# Altium project LimeSDR-USB_1v4s.PrjPcb (part 2 of 7)

## Sheet 06_LMS7002M_RF2.SchDoc: LMS7002M RF
size A3; Organization: Lime Microsystems; Address1: Surrey Tech Centre; Address2: Guildford GU2 7YG; Address3: Surrey; Address4: United Kingdom; Revision: v1.4s; SheetNumber: 6; SheetTotal: 15
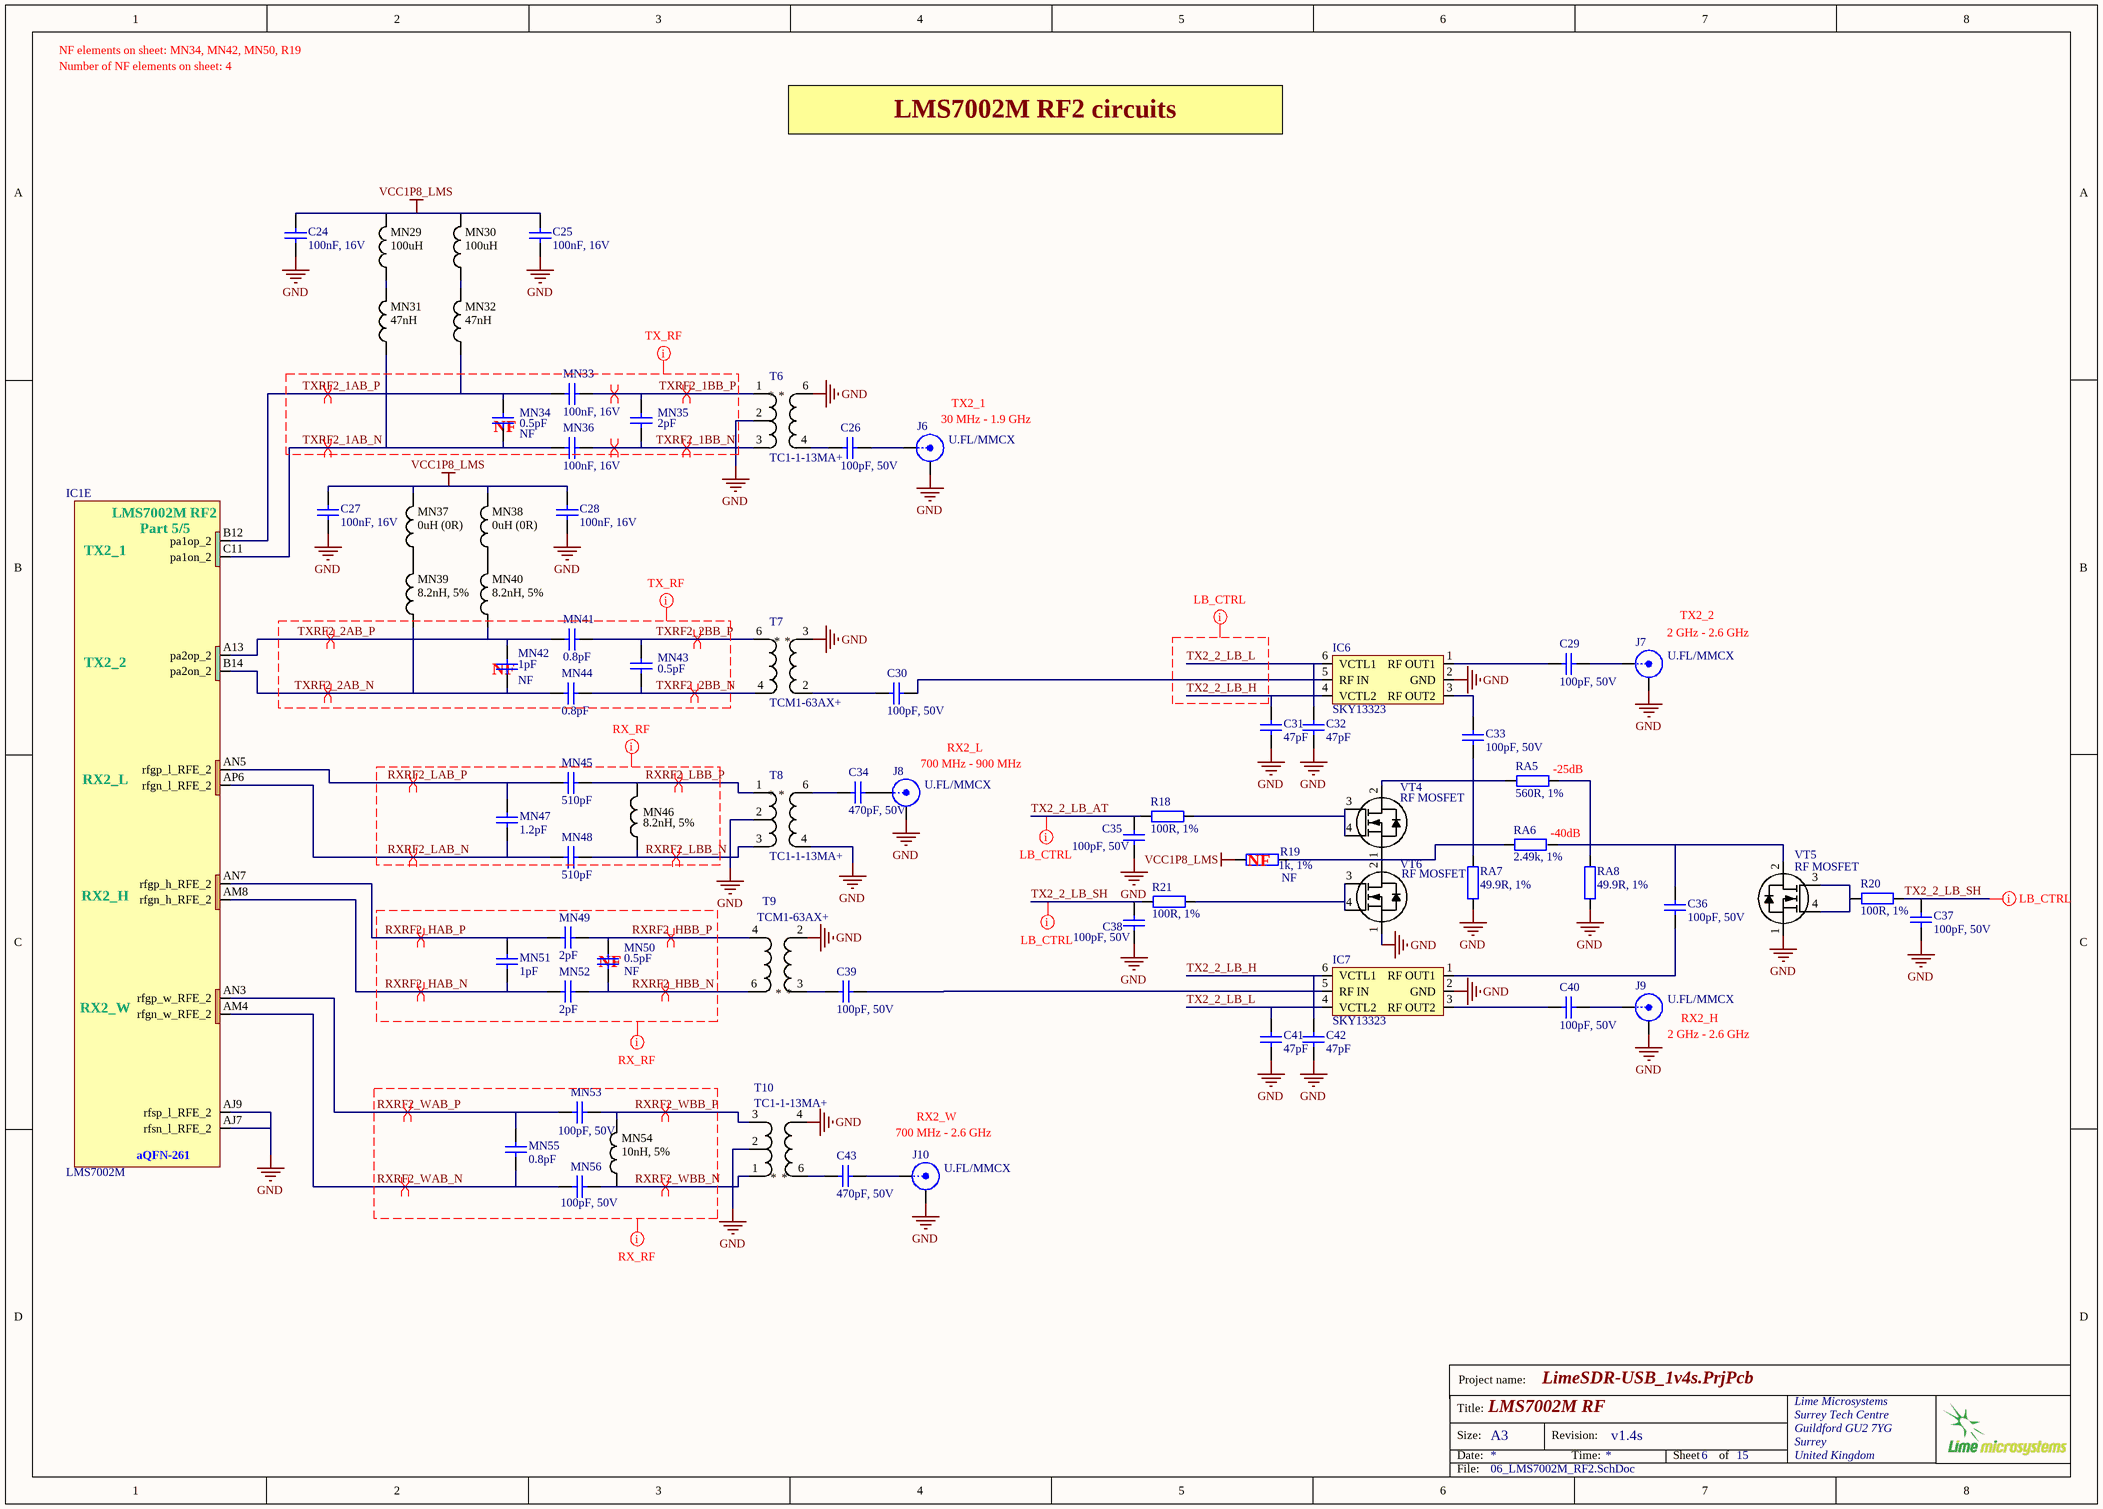
[diagram p5: 06_LMS7002M_RF2.SchDoc]

### Parts
C24  100nF, 16V  [CAP0402]
C25  100nF, 16V  [CAP0402]
C26  100pF, 50V  [CAP0402]
C27  100nF, 16V  [CAP0402]
C28  100nF, 16V  [CAP0402]
C29  100pF, 50V  [CAP0402]
C30  100pF, 50V  [CAP0402]
C31  47pF  [CAP0402]
C32  47pF  [CAP0402]
C33  100pF, 50V  [CAP0402]
C34  470pF, 50V  [CAP0402]
C35  100pF, 50V  [CAP0402]
C36  100pF, 50V  [CAP0402]
C37  100pF, 50V  [CAP0402]
C38  100pF, 50V  [CAP0402]
C39  100pF, 50V  [CAP0402]
C40  100pF, 50V  [CAP0402]
C41  47pF  [CAP0402]
C42  47pF  [CAP0402]
C43  470pF, 50V  [CAP0402]
IC1  LMS7002M  [LMS7002M_v3]  (part E of 5)
IC6  SKY13323  [SKY13323-378LF]
IC7  SKY13323  [SKY13323-378LF]
J6  U.FL/MMCX  [MMCX_UFL_conn_u]
J7  U.FL/MMCX  [MMCX_UFL_conn_u]
J8  U.FL/MMCX  [MMCX_UFL_conn_u]
J9  U.FL/MMCX  [MMCX_UFL_conn_u]
J10  U.FL/MMCX  [MMCX_UFL_conn_u]
MN29  100uH  [RES0805]
MN30  100uH  [RES0805]
MN31  47nH  [RES0402]
MN32  47nH  [RES0402]
MN33  100nF, 16V  [CAP0402]
MN34  0.5pF  Assembly Info: NF  [CAP0402]
MN35  2pF  [CAP0402]
MN36  100nF, 16V  [CAP0402]
MN37  0uH (0R)  [RES0805]
MN38  0uH (0R)  [RES0805]
MN39  8.2nH, 5%  [RES0402]
MN40  8.2nH, 5%  [RES0402]
MN41  0.8pF  [CAP0402]
MN42  1pF  Assembly Info: NF  [CAP0402]
MN43  0.5pF  [CAP0402]
MN44  0.8pF  [CAP0402]
MN45  510pF  [CAP0402]
MN46  8.2nH, 5%  [RES0402]
MN47  1.2pF  [CAP0402]
MN48  510pF  [CAP0402]
MN49  2pF  [CAP0402]
MN50  0.5pF  Assembly Info: NF  [CAP0402]
MN51  1pF  [CAP0402]
MN52  2pF  [CAP0402]
MN53  100pF, 50V  [CAP0402]
MN54  10nH, 5%  [RES0402]
MN55  0.8pF  [CAP0402]
MN56  100pF, 50V  [CAP0402]
R18  100R, 1%  [RES0402]
R19  1k, 1%  Assembly Info: NF  [RES0402]
R20  100R, 1%  [RES0402]
R21  100R, 1%  [RES0402]
RA5  560R, 1%  [RES0402]
RA6  2.49k, 1%  [RES0402]
RA7  49.9R, 1%  [RES0402]
RA8  49.9R, 1%  [RES0402]
T6  TC1-1-13MA+  [TC1-1-13MA+_v2]
T7  TCM1-63AX+  [TCM1-63AX+_v2]
T8  TC1-1-13MA+  [TC1-1-13MA+_v2]
T9  TCM1-63AX+  [TCM1-63AX+_v2]
T10  TC1-1-13MA+  [TC1-1-13MA+_v2]
VT4  RF MOSFET  [BF1105R_SOT143R4]
VT5  RF MOSFET  [BF1105R_SOT143R4]
VT6  RF MOSFET  [BF1105R_SOT143R4]

### Nets
GND: C24.1 C25.1 C27.1 C28.1 C31.1 C32.1 C35.2 C37.2 C38.2 C41.1 C42.1 IC1.AJ7(rfsn_l_RFE_2) IC1.AJ9(rfsp_l_RFE_2) IC6.2(GND) IC7.2(GND) J6.2(Y) J7.2(Y) J8.2(Y) J9.2(Y) J10.2(Y) RA7.1 RA8.1 T6.2 T6.6 T7.3 T8.2 T8.4 T9.2 T10.2 T10.4 VT5.1(S) VT6.1(S)
VCC1P8_LMS: C24.2 C25.2 C27.2 C28.2 MN29.2 MN30.2 MN37.2 MN38.2 R19.2
RXRF2_HAB_N: IC1.AM8(rfgn_h_RFE_2) MN51.1 MN52.2
RXRF2_HAB_P: IC1.AN7(rfgp_h_RFE_2) MN49.2 MN51.2
RXRF2_HBB_N: MN50.1 MN52.1 T9.6
RXRF2_HBB_P: MN49.1 MN50.2 T9.4
RXRF2_LAB_N: IC1.AP6(rfgn_l_RFE_2) MN47.1 MN48.2
RXRF2_LAB_P: IC1.AN5(rfgp_l_RFE_2) MN45.2 MN47.2
RXRF2_LBB_N: MN46.1 MN48.1 T8.3
RXRF2_LBB_P: MN45.1 MN46.2 T8.1
RXRF2_WAB_N: IC1.AM4(rfgn_w_RFE_2) MN55.2 MN56.2
RXRF2_WAB_P: IC1.AN3(rfgp_w_RFE_2) MN53.2 MN55.1
RXRF2_WBB_N: MN54.1 MN56.1 T10.1
RXRF2_WBB_P: MN53.1 MN54.2 T10.3
TX2_2_LB_AT: C35.1 R18.2
TX2_2_LB_H: C31.2 C42.2 IC6.4(VCTL2) IC7.6(VCTL1)
TX2_2_LB_L: C32.2 C41.2 IC6.6(VCTL1) IC7.4(VCTL2)
TX2_2_LB_SH: C37.1 C38.1 R20.1 R21.2
TXRF2_1AB_N: IC1.C11(pa1on_2) MN31.1 MN34.1 MN36.1
TXRF2_1AB_P: IC1.B12(pa1op_2) MN32.1 MN33.2 MN34.2
TXRF2_1BB_N: MN35.1 MN36.2 T6.3
TXRF2_1BB_P: MN33.1 MN35.2 T6.1
TXRF2_2AB_N: IC1.B14(pa2on_2) MN39.1 MN42.2 MN44.2
TXRF2_2AB_P: IC1.A13(pa2op_2) MN40.1 MN41.2 MN42.1
TXRF2_2BB_N: MN43.1 MN44.1 T7.4
TXRF2_2BB_P: MN41.1 MN43.2 T7.6
NetC26_1: C26.1 J6.1(X)
NetC26_2: C26.2 T6.4
NetC29_1: C29.1 J7.1(X)
NetC29_2: C29.2 IC6.1(RF_OUT1)
NetC30_1: C30.1 IC6.5(RF_IN)
NetC30_2: C30.2 T7.2
NetC33_1: C33.1 IC6.3(RF_OUT2)
NetC33_2: C33.2 R19.1 RA6.1 RA7.2 VT4.1(S) VT6.2(D)
NetC34_1: C34.1 J8.1(X)
NetC34_2: C34.2 T8.6
NetC36_1: C36.1 RA5.1 RA6.2 RA8.2 VT5.2(D)
NetC36_2: C36.2 IC7.1(RF_OUT1)
NetC39_1: C39.1 IC7.5(RF_IN)
NetC39_2: C39.2 T9.3
NetC40_1: C40.1 J9.1(X)
NetC40_2: C40.2 IC7.3(RF_OUT2)
NetC43_1: C43.1 J10.1(X)
NetC43_2: C43.2 T10.6
NetMN29_1: MN29.1 MN31.2
NetMN30_1: MN30.1 MN32.2
NetMN37_1: MN37.1 MN39.2
NetMN38_1: MN38.1 MN40.2
NetR18_1: R18.1 VT4.3(G2) VT4.4(G1)
NetR20_2: R20.2 VT5.3(G2) VT5.4(G1)
NetR21_1: R21.1 VT6.3(G2) VT6.4(G1)
NetRA5_2: RA5.2 VT4.2(D)

### Layout directives
differential pair: RXRF2_HAB_N, RXRF2_HAB_P, RXRF2_HBB_N, RXRF2_HBB_P, RXRF2_LAB_N, RXRF2_LAB_P, RXRF2_LBB_N, RXRF2_LBB_P, RXRF2_WAB_N, RXRF2_WAB_P, RXRF2_WBB_N, RXRF2_WBB_P, TXRF2_1AB_N, TXRF2_1AB_P, TXRF2_1BB_N, TXRF2_1BB_P, TXRF2_2AB_N, TXRF2_2AB_P, TXRF2_2BB_N, TXRF2_2BB_P
net class TX_RF: TXRF2_1AB_N, TXRF2_1AB_P, TXRF2_1BB_N, TXRF2_1BB_P, TXRF2_2AB_N, TXRF2_2AB_P, TXRF2_2BB_N, TXRF2_2BB_P
net class RX_RF: RXRF2_HAB_N, RXRF2_HAB_P, RXRF2_HBB_N, RXRF2_HBB_P, RXRF2_LAB_N, RXRF2_LAB_P, RXRF2_LBB_N, RXRF2_LBB_P, RXRF2_WAB_N, RXRF2_WAB_P, RXRF2_WBB_N, RXRF2_WBB_P
net class LB_CTRL: TX2_2_LB_AT, TX2_2_LB_H, TX2_2_LB_L, TX2_2_LB_SH

### Notes on the sheet
- Number of NF elements on sheet: 4
- NF elements on sheet: MN34, MN42, MN50, R19
- LMS7002M RF2 circuits
- (near MN34) NF
- (near J6) 30 MHz - 1.9 GHz
- (near J6) TX2_1
- (near J7) 2 GHz - 2.6 GHz
- (near J7) TX2_2
- (near MN42) NF
- (near J8) 700 MHz - 900 MHz
- RX2_L
- (near RA5) -25dB
- (near RA6) -40dB
- (near R19) NF
- (near MN50) NF
- (near J9) 2 GHz - 2.6 GHz
- (near J9) RX2_H
- (near J10) RX2_W
- 700 MHz - 2.6 GHz
- Project name:
- Title:
- Size:
- Date:
- A3
- Revision:
- Time:
- Sheet
- of
- File:
- (in symbol LMS7002M, part E) LMS7002M RF2; Part 5/5; TX2_1; TX2_2; RX2_L; RX2_H; RX2_W; aQFN-261

### Library data of the parts
C24 C25 C27 C28 = Cap_0402: as C4 on sheet 05_LMS7002M_RF1; Value: 100nF, 16V; Supplier 1: Mouser; Supplier Part Number 1: 81-GRM155R71C104KA88; Case Code - in: 0402; RoHS: RoHS Compliant; Operating Temperature Range: - 55 C to + 125 C; Series: GRM; Termination Style: SMD/SMT; Package / Case: 0402 (1005 metric); Voltage Rating DC: 16 V; Maximum Operating Temperature: + 125 C; Case Code - mm: 1005; Minimum Operating Temperature: - 55 C; Product Category: Low & Medium Capacitance SMD Ceramic Chip Capacitors; Packaging: Reel; Product: General Type MLCCs; Category: Multilayer Ceramic Capacitors MLCC - SMD/SMT; Brand: Murata Electronics; Case Width: 0.5 mm; RoHS - Mouser: Y; Standard Pack Qty: 10000; Minimum Order Quantity: 1; Reeling: True; Manufacturer Part Number 1: GRM155R71C104KA88D
C26 C29 C30 C33 C35-C40 MN53 MN56 = Cap_0402: as C6 on sheet 05_LMS7002M_RF1; Value: 100pF, 50V; Capacitance: 100pF; Thickness (Max): 0.022" (0.55mm); Size / Dimension: 0.039" L x 0.020" W (1.00mm x 0.50mm); RoHS: RoHS Compliant; Ratings: -; Package / Case: 0402 (1005 Metric); Mounting Type: Surface Mount, MLCC; Height - Seated (Max): -; Features: -; Lead Spacing: -; Voltage - Rated: 50V; Operating Temperature: -55°C ~ 125°C; Packaging: Cut Tape (CT); Applications: General Purpose; Lead Style: -; Supplier 1: Digi-Key; Category: Capacitors; Supplier Part Number 1: 311-1024-1-ND
C31 C32 C41 C42 = Cap_0402: as C11 on sheet 05_LMS7002M_RF1; Value: 47pF; Supplier 1: Digi-Key; Supplier Part Number 1: 445-5361-1-ND; Package / Case: 0402 (1005 Metric); Lead Spacing: -; Ratings: -; Mounting Type: Surface Mount, MLCC; Operating Temperature: -55°C ~ 125°C; Thickness (Max): 0.022" (0.55mm); Capacitance: 47pF; Packaging: Cut Tape (CT); Features: -; Applications: General Purpose; Lead Style: -; Size / Dimension: 0.039" L x 0.020" W (1.00mm x 0.50mm); Height - Seated (Max): -; RoHS: RoHS Compliant; Category: Capacitors
C34 C43 = Cap_0402: as C14 on sheet 05_LMS7002M_RF1; Value: 470pF, 50V; Supplier 1: Digi-Key; Supplier Part Number 1: 445-2656-6-ND; Ratings: -; Package / Case: 0402 (1005 Metric); Capacitance: 470pF; Packaging: Digi-Reel®; RoHS: RoHS Compliant; Lead Style: -; Thickness (Max): 0.022" (0.55mm); Size / Dimension: 0.039" L x 0.020" W (1.00mm x 0.50mm); Lead Spacing: -; Operating Temperature: -55°C ~ 125°C; Height - Seated (Max): -; Applications: General Purpose; Mounting Type: Surface Mount, MLCC; Voltage - Rated: 50V; Category: Capacitors; Features: -
IC1 = LMS7002M: as IC1 on sheet 05_LMS7002M_RF1; Manufacturer Part Number 1: LMS7002M; Supplier 1: Lime Microsystems; Supplier Part Number 1: LMS7002M
IC6 IC7 = SKY13323: as IC4 on sheet 05_LMS7002M_RF1; Supplier 1: Digi-Key; Operating Temperature: -40°C ~ 85°C; RoHS: RoHS Compliant; Package / Case: 6-XFDFN Exposed Pad; Circuit: SPDT; Features: -; Supplier Device Package: 6-MLPD (1x1); Category: RF/IF and RFID; Packaging: Cut Tape (CT); Manufacturer Part Number 1: SKY13323-378LF; Supplier Part Number 1: 683-1334-1-ND
J6-J10 = RF_IF_connector: as J1 on sheet 05_LMS7002M_RF1; Cable Group: -; Category: Connectors, Interconnects; Fastening Type: Snap-On; Features: -; Housing Color: Silver; Ingress Protection: -; Mounting Type: Surface Mount; Operating Temperature: -40°C ~ 90°C; Packaging: Cut Tape (CT); RoHS: RoHS Compliant; Shield Termination: Solder; Supplier 1: Digi-Key; Supplier Part Number 1: WM5587CT-ND; Part Description: CONN UMC RCPT STR 50 OHM SMD
MN29 MN30 = Inductor_0603: as MN1 on sheet 05_LMS7002M_RF1; Value: 100uH; Supplier 1: Digi-Key; Supplier Part Number 1: 445-1071-1-ND; Supplier Device Package: 0805 (2012 Metric); Size / Dimension: 0.079" L x 0.049" W (2.00mm x 1.25mm); Operating Temperature: -40°C ~ 85°C; Packaging: Cut Tape (CT); RoHS: RoHS Compliant; Current - Saturation: -; Height - Seated (Max): 0.057" (1.45mm); Package / Case: 0805 (2012 Metric); Mounting Type: Surface Mount; Type: Multilayer; Category: Inductors, Coils, Chokes
MN31 MN32 = Inductor_0603: as MN3 on sheet 05_LMS7002M_RF1; Supplier 1: Farnell; Supplier Part Number 1: 2285856; Packaging: Cut Tape; RoHS: Y-EX; value: 47nH
MN33 MN36 = Cap_0402: as MN5 on sheet 05_LMS7002M_RF1; Value: 100nF, 16V; Supplier 1: Mouser; Supplier Part Number 1: 81-GRM155R71C104KA88; Case Code - in: 0402; RoHS: RoHS Compliant; Operating Temperature Range: - 55 C to + 125 C; Series: GRM; Termination Style: SMD/SMT; Package / Case: 0402 (1005 metric); Voltage Rating DC: 16 V; Type: General Purpose MLCC; Maximum Operating Temperature: + 125 C; Case Code - mm: 1005; Minimum Operating Temperature: - 55 C; Product Category: Low & Medium Capacitance SMD Ceramic Chip Capacitors; Packaging: Reel; Product: General Type MLCCs; Category: Multilayer Ceramic Capacitors MLCC - SMD/SMT; Brand: Murata Electronics; Case Width: 0.5 mm; RoHS - Mouser: Y; Standard Pack Qty: 10000; Minimum Order Quantity: 1; Reeling: True; Manufacturer Part Number 1: GRM155R71C104KA88D
MN34 MN43 MN50 = Cap_0402: as MN6 on sheet 05_LMS7002M_RF1; Value: 0.5pF; Supplier 1: Digi-Key; Supplier Part Number 1: 311-1001-1-ND; RoHS: RoHS Compliant; Thickness (Max): 0.022" (0.55mm); Features: -; Height - Seated (Max): -; Lead Spacing: -; Applications: General Purpose; Packaging: Cut Tape (CT); Ratings: -; Size / Dimension: 0.039" L x 0.020" W (1.00mm x 0.50mm); Lead Style: -; Mounting Type: Surface Mount, MLCC; Operating Temperature: -55°C ~ 125°C; Package / Case: 0402 (1005 Metric); Category: Capacitors
MN35 MN49 MN52 = Cap_0402: as MN7 on sheet 05_LMS7002M_RF1; Value: 2pF; Supplier 1: Farnell; Supplier Part Number 1: 2332536; Operating Temperature Max: 125; RoHS: YES; Operating Temperature Min: -55; Capacitance Tolerance ±: ± 0.1; Packaging: Cut Tape; MSL: MSL 1 - Unlimited
MN37 MN38 = Inductor_0603: as MN9 on sheet 05_LMS7002M_RF1; Value: 0uH (0R); Supplier 1: Farnell; Supplier Part Number 1: 2008388; RoHS: YES
MN39 MN40 MN46 = Inductor_0603: as MN11 on sheet 05_LMS7002M_RF1; Supplier 1: Farnell; Supplier Part Number 1: 2285826; Packaging: Cut Tape; Product Range: COILCRAFT - 0402; Inductance Tolerance: ± 5%; RoHS: Y-EX; Value: 8.2nH, 5%
MN41 MN44 MN55 = Cap_0402: as MN13 on sheet 05_LMS7002M_RF1; Value: 0.8pF; Applications: General Purpose; Operating Temperature: -55°C ~ 125°C; Size / Dimension: 0.039" L x 0.020" W (1.00mm x 0.50mm); Features: -; Supplier 1: Digi-Key; Height - Seated (Max): -; Category: Capacitors; Package / Case: 0402 (1005 Metric); Mounting Type: Surface Mount, MLCC; Lead Spacing: -; Thickness (Max): 0.022" (0.55mm); RoHS: RoHS Compliant; Supplier Part Number 1: 490-6269-1-ND; Packaging: Cut Tape (CT); Ratings: -; Lead Style: -
MN42 MN51 = Cap_0402: as MN14 on sheet 05_LMS7002M_RF1; Value: 1pF; Supplier 1: Digi-Key; Supplier Part Number 1: 445-4854-6-ND; Size / Dimension: 0.039" L x 0.020" W (1.00mm x 0.50mm); Lead Spacing: -; Operating Temperature: -55°C ~ 125°C; Thickness (Max): 0.022" (0.55mm); Package / Case: 0402 (1005 Metric); Features: -; Lead Style: -; Applications: General Purpose; Height - Seated (Max): -; Capacitance: 1pF; RoHS: RoHS Compliant; Mounting Type: Surface Mount, MLCC; Packaging: Digi-Reel®; Ratings: -; Category: Capacitors
MN45 MN48 = Cap_0402: as MN17 on sheet 05_LMS7002M_RF1; Value: 510pF; Supplier 1: Digi-Key; Supplier Part Number 1: 490-3237-1-ND; Height - Seated (Max): -; Features: -; Size / Dimension: 0.039" L x 0.020" W (1.00mm x 0.50mm); Applications: General Purpose; Lead Spacing: -; Package / Case: 0402 (1005 Metric); Ratings: -; Thickness (Max): 0.022" (0.55mm); Lead Style: -; Operating Temperature: -55°C ~ 125°C; Mounting Type: Surface Mount, MLCC; Capacitance: 510pF; Category: Capacitors; RoHS: RoHS Compliant; Packaging: Cut Tape (CT)
MN47 = Cap_0402: as MN19 on sheet 05_LMS7002M_RF1; Value: 1.2pF; Supplier 1: Digi-Key; Supplier Part Number 1: 490-5927-1-ND; Lead Style: -; Category: Capacitors; Features: -; Packaging: Cut Tape (CT); Operating Temperature: -55°C ~ 125°C; Package / Case: 0402 (1005 Metric); Applications: General Purpose; Size / Dimension: 0.039" L x 0.020" W (1.00mm x 0.50mm); Lead Spacing: -; Ratings: -; Mounting Type: Surface Mount, MLCC; RoHS: RoHS Compliant; Height - Seated (Max): -; Thickness (Max): 0.022" (0.55mm); Capacitance: 1.2pF
MN54 = Inductor_0603: as MN26 on sheet 05_LMS7002M_RF1; Value: 10nH, 5%; Supplier 1: Farnell; Supplier Part Number 1: 2285830; RoHS: Y-EX
R18 R20 R21 = Res_0402: as R14 on sheet 05_LMS7002M_RF1; Supplier 1: Digi-Key; Supplier Part Number 1: RMCF0402FT100RDKR-ND; Package / Case: 0402 (1005 Metric); Composition: Thick Film; Category: Resistors; Tolerance: ±1%; Value: 100R, 1%
R19 = Res_0402: as R15 on sheet 05_LMS7002M_RF1; Value: 1k, 1%; Supplier 1: Digi-Key; Supplier Part Number 1: RMCF0402FT1K00TR-ND; Resistance (Ohms): 1k; Packaging: Tape & Reel (TR); Category: Resistors; RoHS: RoHS Compliant; Tolerance: ±1%; Height: 0.016" (0.40mm); Number of Terminations: 2; Package / Case: 0402 (1005 Metric); Operating Temperature: -55°C ~ 155°C; Features: -; Composition: Thick Film; Supplier Device Package: 0402; Size / Dimension: 0.039" L x 0.020" W (1.00mm x 0.50mm)
RA5 = Res_0402: as RA1 on sheet 05_LMS7002M_RF1; RoHS: RoHS Compliant; Packaging: Cut Tape (CT); Composition: Thick Film; Tolerance: ±1%; Number of Terminations: 2; Supplier Device Package: 0402 (1005 Metric); Operating Temperature: -55°C ~ 155°C; Features: Automotive AEC-Q200; Category: Resistors; Supplier Part Number 1: 541-560LCT-ND; Package / Case: 0402 (1005 Metric); Supplier 1: Digi-Key; Height: 0.016" (0.40mm); Size / Dimension: 0.039" L x 0.020" W (1.00mm x 0.50mm)
RA6 = Res_0402: as RA2 on sheet 05_LMS7002M_RF1; Value: 2.49k, 1%; Size / Dimension: 0.039" L x 0.020" W (1.00mm x 0.50mm); Height: 0.016" (0.40mm); Features: Moisture Resistant; Resistance (Ohms): 2.49k; Operating Temperature: -55°C ~ 155°C; Tolerance: ±1%; Composition: Thick Film; Supplier Device Package: 0402; Package / Case: 0402 (1005 Metric); Number of Terminations: 2; Category: Resistors; Packaging: Digi-Reel®; Supplier Part Number 1: 311-2.49KLRDKR-ND; RoHS: RoHS Compliant; Supplier 1: Digi-Key
RA7 RA8 = Res_0402: as R6 on sheet 04_LMS7002M_Misc; Number of Terminations: 2; Size / Dimension: 0.039" L x 0.020" W (1.00mm x 0.50mm); Supplier Device Package: 0402 (1005 Metric); RoHS: RoHS Compliant; Supplier Part Number 1: 1276-3469-6-ND; Features: -; Packaging: Digi-Reel®; Tolerance: ±1%; Height: 0.016" (0.40mm); Category: Resistors; Composition: Thick Film; Package / Case: 0402 (1005 Metric); Supplier 1: Digi-Key; Operating Temperature: -55°C ~ 155°C; Value: 49.9R, 1%
T6 T8 T10 = Balun: as T1 on sheet 05_LMS7002M_RF1; Manufacturer Part Number 1: TC1-1-13MA+; Supplier Part Number 1: TC1-1-13MA+; Supplier 1: Minicircuits
T7 T9 = Balun_v2: as T2 on sheet 05_LMS7002M_RF1; Supplier Part Number 1: TCM1-63AX+; Manufacturer Part Number 1: TCM1-63AX+; Supplier 1: Minicircuits
VT4-VT6 = BF1105R,215: as VT1 on sheet 05_LMS7002M_RF1; Supplier 1: Digi-Key; RoHS: RoHS Compliant; Supplier Device Package: SOT-143R; Power - Output: -; Current - Test: -; Manufacturer Part Number 1: BF1105R,215; Packaging: Digi-Reel®; Package / Case: SOT-143R; Category: Discrete Semiconductor Products; Supplier Part Number 1: 568-12530-6-ND

## Sheet 07_LMS7002M_Power.SchDoc: LMS7002M power supply
size A3 portrait; Organization: Lime Microsystems; Address1: Surrey Tech Centre; Address2: Guildford GU2 7YG; Address3: Surrey; Address4: United Kingdom; Revision: v1.4s; SheetNumber: 7; SheetTotal: 15; PageSetup: Record=PageOptions|CenterHorizontal=True|CenterVertical=True|PrintScale=0.70|XCorrection=1.00|YCorrection=1.00|PrintKind=1|BorderSize=5000000|LeftOffset=0|BottomOffset=0|Orientation=1|PaperLength=2970|PaperWidth=2100|Scale=100|PaperSource=7|PrintQuality=600|MediaType=1|DitherType=10|PrintScaleMode=1|PaperKind=A4|PaperIndex=9
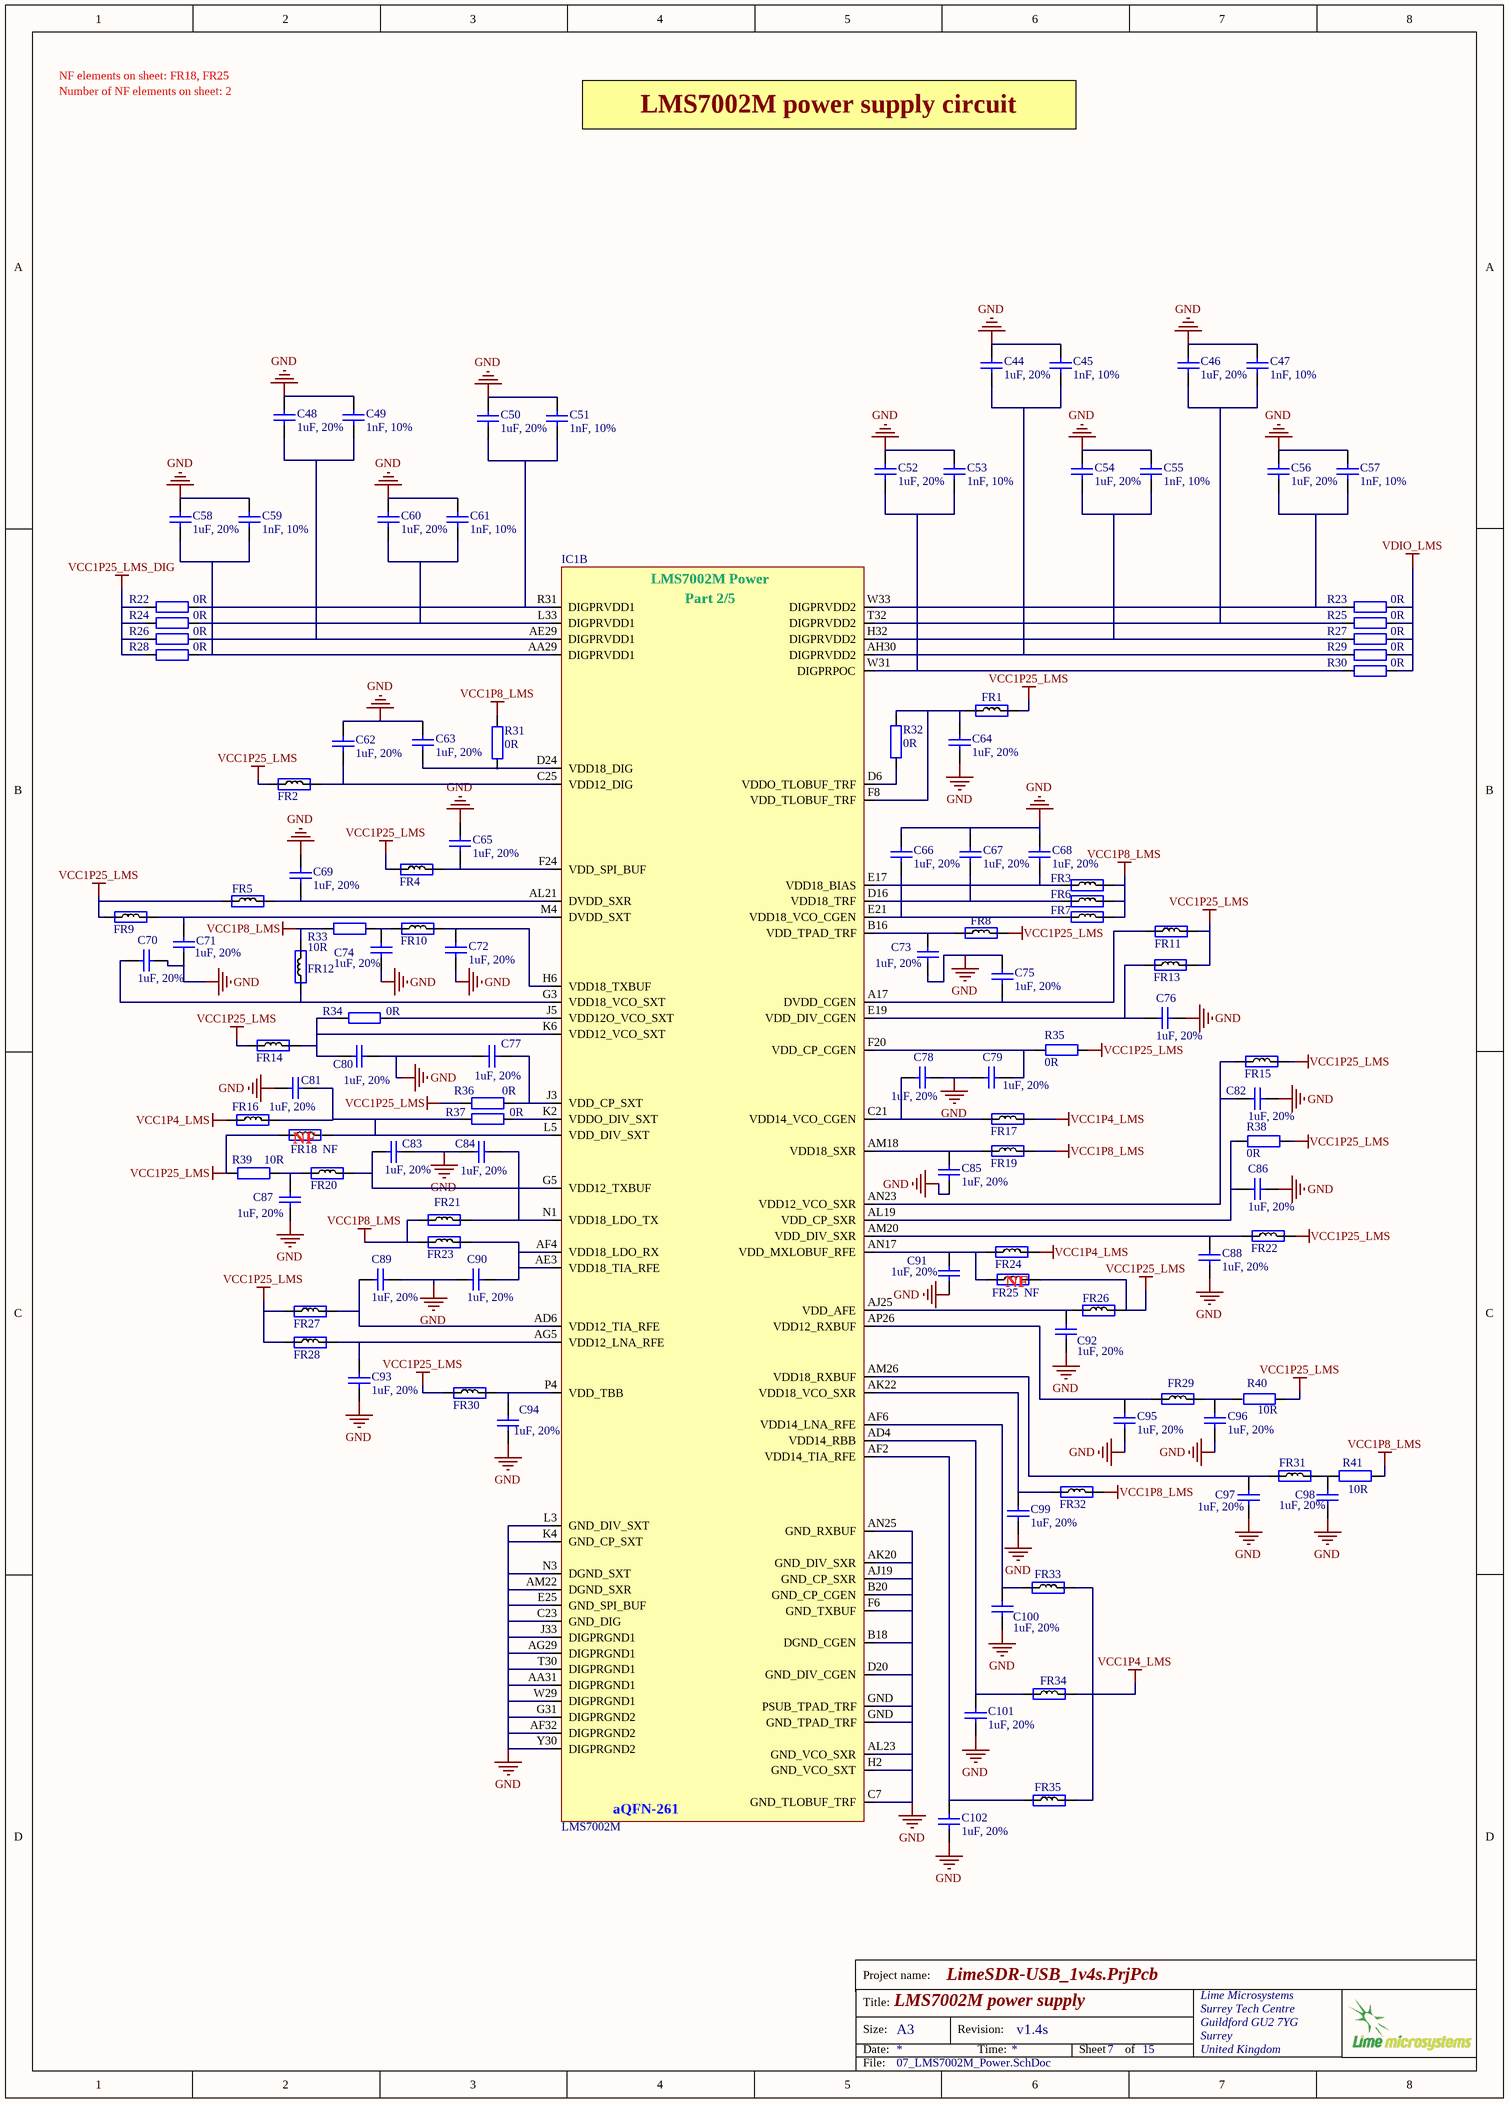
[diagram p6: 07_LMS7002M_Power.SchDoc]

### Parts
C44  1uF, 20%  [CAP0201]
C45  1nF, 10%  [CAP0201]
C46  1uF, 20%  [CAP0201]
C47  1nF, 10%  [CAP0201]
C48  1uF, 20%  [CAP0201]
C49  1nF, 10%  [CAP0201]
C50  1uF, 20%  [CAP0201]
C51  1nF, 10%  [CAP0201]
C52  1uF, 20%  [CAP0201]
C53  1nF, 10%  [CAP0201]
C54  1uF, 20%  [CAP0201]
C55  1nF, 10%  [CAP0201]
C56  1uF, 20%  [CAP0201]
C57  1nF, 10%  [CAP0201]
C58  1uF, 20%  [CAP0201]
C59  1nF, 10%  [CAP0201]
C60  1uF, 20%  [CAP0201]
C61  1nF, 10%  [CAP0201]
C62  1uF, 20%  [CAP0201]
C63  1uF, 20%  [CAP0201]
C64  1uF, 20%  [CAP0201]
C65  1uF, 20%  [CAP0201]
C66  1uF, 20%  [CAP0201]
C67  1uF, 20%  [CAP0201]
C68  1uF, 20%  [CAP0201]
C69  1uF, 20%  [CAP0201]
C70  1uF, 20%  [CAP0201]
C71  1uF, 20%  [CAP0201]
C72  1uF, 20%  [CAP0201]
C73  1uF, 20%  [CAP0201]
C74  1uF, 20%  [CAP0201]
C75  1uF, 20%  [CAP0201]
C76  1uF, 20%  [CAP0201]
C77  1uF, 20%  [CAP0201]
C78  1uF, 20%  [CAP0201]
C79  1uF, 20%  [CAP0201]
C80  1uF, 20%  [CAP0201]
C81  1uF, 20%  [CAP0201]
C82  1uF, 20%  [CAP0201]
C83  1uF, 20%  [CAP0201]
C84  1uF, 20%  [CAP0201]
C85  1uF, 20%  [CAP0201]
C86  1uF, 20%  [CAP0201]
C87  1uF, 20%  [CAP0201]
C88  1uF, 20%  [CAP0201]
C89  1uF, 20%  [CAP0201]
C90  1uF, 20%  [CAP0201]
C91  1uF, 20%  [CAP0201]
C92  1uF, 20%  [CAP0201]
C93  1uF, 20%  [CAP0201]
C94  1uF, 20%  [CAP0201]
C95  1uF, 20%  [CAP0201]
C96  1uF, 20%  [CAP0201]
C97  1uF, 20%  [CAP0201]
C98  1uF, 20%  [CAP0201]
C99  1uF, 20%  [CAP0201]
C100  1uF, 20%  [CAP0201]
C101  1uF, 20%  [CAP0201]
C102  1uF, 20%  [CAP0201]
FR1  600R, 0.27A  [RES0201]  (value not drawn)
FR2  600R, 0.27A  [RES0201]  (value not drawn)
FR3  600R, 0.27A  [RES0201]  (value not drawn)
FR4  600R, 0.27A  [RES0201]  (value not drawn)
FR5  600R, 0.27A  [RES0201]  (value not drawn)
FR6  600R, 0.27A  [RES0201]  (value not drawn)
FR7  600R, 0.27A  [RES0201]  (value not drawn)
FR8  600R, 0.27A  [RES0201]  (value not drawn)
FR9  600R, 0.27A  [RES0201]  (value not drawn)
FR10  600R, 0.27A  [RES0201]  (value not drawn)
FR11  600R, 0.27A  [RES0201]  (value not drawn)
FR12  600R, 0.27A  [RES0201]  (value not drawn)
FR13  600R, 0.27A  [RES0201]  (value not drawn)
FR14  600R, 0.27A  [RES0201]  (value not drawn)
FR15  600R, 0.27A  [RES0201]  (value not drawn)
FR16  600R, 0.27A  [RES0201]  (value not drawn)
FR17  600R, 0.27A  [RES0201]  (value not drawn)
FR18  Assembly Info: NF  [RES0201]  (hidden comment: 600R, 0.27A)
FR19  600R, 0.27A  [RES0201]  (value not drawn)
FR20  600R, 0.27A  [RES0201]  (value not drawn)
FR21  600R, 0.27A  [RES0201]  (value not drawn)
FR22  600R, 0.27A  [RES0201]  (value not drawn)
FR23  600R, 0.27A  [RES0201]  (value not drawn)
FR24  600R, 0.27A  [RES0201]  (value not drawn)
FR25  Assembly Info: NF  [RES0201]  (hidden comment: 600R, 0.27A)
FR26  600R, 0.27A  [RES0201]  (value not drawn)
FR27  600R, 0.27A  [RES0201]  (value not drawn)
FR28  600R, 0.27A  [RES0201]  (value not drawn)
FR29  600R, 0.27A  [RES0201]  (value not drawn)
FR30  600R, 0.27A  [RES0201]  (value not drawn)
FR31  600R, 0.27A  [RES0201]  (value not drawn)
FR32  600R, 0.27A  [RES0201]  (value not drawn)
FR33  600R, 0.27A  [RES0201]  (value not drawn)
FR34  600R, 0.27A  [RES0201]  (value not drawn)
FR35  600R, 0.27A  [RES0201]  (value not drawn)
IC1  LMS7002M  [LMS7002M_v3]  (part B of 5)
R22  0R  [RES0402]
R23  0R  [RES0402]
R24  0R  [RES0402]
R25  0R  [RES0402]
R26  0R  [RES0402]
R27  0R  [RES0402]
R28  0R  [RES0402]
R29  0R  [RES0402]
R30  0R  [RES0402]
R31  0R  [RES0201]
R32  0R  [RES0201]
R33  10R  [RES0201]
R34  0R  [RES0201]
R35  0R  [RES0201]
R36  0R  [RES0201]
R37  0R  [RES0201]
R38  0R  [RES0201]
R39  10R  [RES0201]
R40  10R  [RES0201]
R41  10R  [RES0201]

### Nets
GND: C44.2 C45.2 C46.2 C47.2 C48.2 C49.2 C50.2 C51.2 C52.2 C53.2 C54.2 C55.2 C56.2 C57.2 C58.2 C59.2 C60.2 C61.2 C62.2 C63.2 C64.2 C65.2 C66.2 C67.2 C68.2 C69.2 C70.2 C71.2 C72.2 C73.2 C74.2 C75.2 C76.2 C77.2 C78.2 C79.2 C80.1 C81.2 C82.2 C83.2 C84.2 C85.2 C86.2 C87.2 C88.2 C89.2 C90.2 C91.2 C92.2 C93.2 C94.2 C95.2 C96.2 C97.2 C98.2 C99.2 C100.2 C101.2 C102.2 IC1.AA31(DIGPRGND1) IC1.AF32(DIGPRGND2) IC1.AG29(DIGPRGND1) IC1.AJ19(GND_CP_SXR) IC1.AK20(GND_DIV_SXR) IC1.AL23(GND_VCO_SXR) IC1.AM22(DGND_SXR) IC1.AN25(GND_RXBUF) IC1.B18(DGND_CGEN) IC1.B20(GND_CP_CGEN) IC1.C7(GND_TLOBUF_TRF) IC1.C23(GND_DIG) IC1.D20(GND_DIV_CGEN) IC1.E25(GND_SPI_BUF) IC1.F6(GND_TXBUF) IC1.G31(DIGPRGND2) IC1.GND(PSUB_TPAD_TRF) IC1.H2(GND_VCO_SXT) IC1.J33(DIGPRGND1) IC1.K4(GND_CP_SXT) IC1.L3(GND_DIV_SXT) IC1.N3(DGND_SXT) IC1.T30(DIGPRGND1) IC1.W29(DIGPRGND1) IC1.Y30(DIGPRGND2)
VCC1P4_LMS: FR16.1 FR17.2 FR24.2 FR33.2 FR34.2 FR35.2
VCC1P8_LMS: FR3.2 FR6.2 FR7.2 FR12.2 FR19.2 FR21.1 FR23.1 FR32.2 R31.2 R33.2 R41.1
VCC1P25_LMS: FR1.2 FR2.1 FR4.1 FR5.1 FR8.2 FR9.1 FR11.2 FR13.2 FR14.1 FR15.2 FR18.1 FR22.2 FR25.2 FR26.2 FR27.1 FR28.1 FR30.1 R35.1 R36.2 R38.1 R39.2 R40.1
VCC1P25_LMS_DIG: R22.2 R24.2 R26.2 R28.2
VDIO_LMS: R23.1 R25.1 R27.1 R29.1 R30.1
NetC44_1: C44.1 C45.1 IC1.AH30(DIGPRVDD2) R29.2
NetC46_1: C46.1 C47.1 IC1.T32(DIGPRVDD2) R25.2
NetC48_1: C48.1 C49.1 IC1.AE29(DIGPRVDD1) R26.1
NetC50_1: C50.1 C51.1 IC1.R31(DIGPRVDD1) R22.1
NetC52_1: C52.1 C53.1 IC1.W31(DIGPRPOC) R30.2
NetC54_1: C54.1 C55.1 IC1.H32(DIGPRVDD2) R27.2
NetC56_1: C56.1 C57.1 IC1.W33(DIGPRVDD2) R23.2
NetC58_1: C58.1 C59.1 IC1.AA29(DIGPRVDD1) R28.1
NetC60_1: C60.1 C61.1 IC1.L33(DIGPRVDD1) R24.1
NetC62_1: C62.1 FR2.2 IC1.C25(VDD12_DIG)
NetC63_1: C63.1 IC1.D24(VDD18_DIG) R31.1
NetC64_1: C64.1 FR1.1 IC1.F8(VDD_TLOBUF_TRF) R32.1
NetC65_1: C65.1 FR4.2 IC1.F24(VDD_SPI_BUF)
NetC66_1: C66.1 FR7.1 IC1.E21(VDD18_VCO_CGEN)
NetC67_1: C67.1 FR6.1 IC1.D16(VDD18_TRF)
NetC68_1: C68.1 FR3.1 IC1.E17(VDD18_BIAS)
NetC69_1: C69.1 FR5.2 IC1.AL21(DVDD_SXR)
NetC70_1: C70.1 FR12.1 IC1.G3(VDD18_VCO_SXT)
NetC71_1: C71.1 FR9.2 IC1.M4(DVDD_SXT)
NetC72_1: C72.1 FR10.2 IC1.H6(VDD18_TXBUF)
NetC73_1: C73.1 FR8.1 IC1.B16(VDD_TPAD_TRF)
NetC74_1: C74.1 FR10.1 R33.1
NetC75_1: C75.1 FR11.1 IC1.A17(DVDD_CGEN)
NetC76_1: C76.1 FR13.1 IC1.E19(VDD_DIV_CGEN)
NetC77_1: C77.1 IC1.J3(VDD_CP_SXT) R36.1
NetC78_1: C78.1 FR17.1 IC1.C21(VDD14_VCO_CGEN)
NetC79_1: C79.1 IC1.F20(VDD_CP_CGEN) R35.2
NetC80_2: C80.2 FR14.2 IC1.K6(VDD12_VCO_SXT) R34.2
NetC81_1: C81.1 FR16.2 FR18.2 IC1.L5(VDD_DIV_SXT) R37.2
NetC82_1: C82.1 FR15.1 IC1.AN23(VDD12_VCO_SXR)
NetC83_1: C83.1 FR20.2 IC1.G5(VDD12_TXBUF)
NetC84_1: C84.1 FR21.2 IC1.N1(VDD18_LDO_TX)
NetC85_1: C85.1 FR19.1 IC1.AM18(VDD18_SXR)
NetC86_1: C86.1 IC1.AL19(VDD_CP_SXR) R38.2
NetC87_1: C87.1 FR20.1 R39.1
NetC88_1: C88.1 FR22.1 IC1.AM20(VDD_DIV_SXR)
NetC89_1: C89.1 FR27.2 IC1.AD6(VDD12_TIA_RFE)
NetC90_1: C90.1 FR23.2 IC1.AE3(VDD18_TIA_RFE) IC1.AF4(VDD18_LDO_RX)
NetC91_1: C91.1 FR24.1 FR25.1 IC1.AN17(VDD_MXLOBUF_RFE)
NetC92_1: C92.1 FR26.1 IC1.AJ25(VDD_AFE)
NetC93_1: C93.1 FR28.2 IC1.AG5(VDD12_LNA_RFE)
NetC94_1: C94.1 FR30.2 IC1.P4(VDD_TBB)
NetC95_1: C95.1 FR29.1 IC1.AP26(VDD12_RXBUF)
NetC96_1: C96.1 FR29.2 R40.2
NetC97_1: C97.1 FR31.1 IC1.AM26(VDD18_RXBUF)
NetC98_1: C98.1 FR31.2 R41.2
NetC99_1: C99.1 FR32.1 IC1.AK22(VDD18_VCO_SXR)
NetC100_1: C100.1 FR33.1 IC1.AF6(VDD14_LNA_RFE)
NetC101_1: C101.1 FR34.1 IC1.AD4(VDD14_RBB)
NetC102_1: C102.1 FR35.1 IC1.AF2(VDD14_TIA_RFE)
NetIC1_D6: IC1.D6(VDDO_TLOBUF_TRF) R32.2
NetIC1_J5: IC1.J5(VDD12O_VCO_SXT) R34.1
NetIC1_K2: IC1.K2(VDDO_DIV_SXT) R37.1

### Notes on the sheet
- Number of NF elements on sheet: 2
- NF elements on sheet: FR18, FR25
- LMS7002M power supply circuit
- (near FR18) NF
- (near FR25) NF
- Project name:
- Title:
- Size:
- Date:
- A3
- Revision:
- Time:
- Sheet
- of
- File:
- (in symbol LMS7002M, part B) LMS7002M Power; Part 2/5; aQFN-261

### Library data of the parts
C44 C46 C48 C50 C52 C54 C56 C58 C60 C62-C102 = Cap_0402: Manufacturer: TDK Corporation; Manufacturer Part Number 1: C0603X5R0J105M030BC; Part Description: 1µF ±20% 6.3V X5R Ceramic Capacitor -55°C ~ 85°C Surface Mount, MLCC 0201 (0603 Metric) 0.024" L x 0.012" W (0.60mm x 0.30mm); Capacitance: 1.0µF; Voltage - Rated: 6.3V; Temperature Coefficient: X5R; Value: 1uF, 20%; Supplier 1: Digi-Key; Supplier Part Number 1: 445-8008-1-ND; Applications: General Purpose; Features: -; Lead Style: -; Ratings: -; Thickness (Max): -; Lead Spacing: -; Height - Seated (Max): -; Size / Dimension: 0.024" L x 0.012" W (0.60mm x 0.30mm); Mounting Type: Surface Mount, MLCC; Operating Temperature: -55°C ~ 85°C; Package / Case: 0201 (0603 Metric); Tolerance: ±20%; Packaging: Cut Tape (CT); Category: Capacitors; RoHS: RoHS Compliant
C45 C47 C49 C51 C53 C55 C57 C59 C61 = Cap_0402: Manufacturer Part Number 1: C0603X7R1E102K030BA; Manufacturer: TDK Corporation; Part Description: 1000pF ±10% 25V X7R Ceramic Capacitor -55°C ~ 125°C Surface Mount, MLCC 0201 (0603 Metric) 0.024" L x 0.012" W (0.60mm x 0.30mm); Voltage - Rated: 25V; Temperature Coefficient: X7R; Capacitance: 1000pF; Value: 1nF, 10%; Supplier 1: Digi-Key; Supplier Part Number 1: 445-7275-1-ND; Features: -; Package / Case: 0201 (0603 Metric); Lead Spacing: -; Mounting Type: Surface Mount, MLCC; Lead Style: -; Height - Seated (Max): -; Operating Temperature: -55°C ~ 125°C; Tolerance: ±10%; Size / Dimension: 0.024" L x 0.012" W (0.60mm x 0.30mm); Applications: General Purpose; Ratings: -; Thickness (Max): 0.013" (0.33mm); RoHS: RoHS Compliant; Packaging: Cut Tape (CT); Category: Capacitors
FR1-FR35 = Ferrite: Manufacturer Part Number 1: BK0603TS601-T; Manufacturer: Taiyo Yuden; Part Description: FERRITE BEAD 600 OHM 0201 1LN; DC Resistance (DCR): 750 mOhm Max; Filter Type: Differential Mode - Single; Impedance @ Frequency: 600 Ohm @ 100MHz; Current Rating: 270mA; Supplier 1: Digi-Key; Supplier Part Number 1: 587-3277-1-ND; Size / Dimension: 0.024" L x 0.012" W (0.60mm x 0.30mm); Package / Case: 0201 (0603 Metric); Height (Max): 0.013" (0.33mm); Mounting Type: Surface Mount; Packaging: Cut Tape (CT); RoHS: RoHS Compliant; Category: Filters; Value: 600R, 0.27A
IC1 = LMS7002M: as IC1 on sheet 05_LMS7002M_RF1; Manufacturer Part Number 1: LMS7002M; Supplier 1: Lime Microsystems; Supplier Part Number 1: LMS7002M
R22-R30 = Res_0402: Manufacturer Part Number 1: RC0402JR-070RL; Manufacturer: Yageo; Part Description: RES SMD 0.0OHM JUMPER 1/16W 0402; Resistance (Ohms): 0.0; Tolerance: Jumper; Power (Watts): 0.063W, 1/16W; Value: 0R; Supplier 1: Digi-Key; Supplier Part Number 1: 311-0.0JRTR-ND; Category: Resistors; Temperature Coefficient: -; Features: Moisture Resistant; Supplier Device Package: 0402; Height: 0.016" (0.40mm); Package / Case: 0402 (1005 Metric); Operating Temperature: -55°C ~ 155°C; Size / Dimension: 0.039" L x 0.020" W (1.00mm x 0.50mm); Composition: Thick Film; Packaging: Tape & Reel (TR); Number of Terminations: 2; RoHS: RoHS Compliant
R31 R32 R34-R38 = Res_0402: Manufacturer Part Number 1: MCR006YRTJ000; Manufacturer: Rohm Semiconductor; Part Description: RES SMD 0.0OHM JUMPER 1/20W 0201; Resistance (Ohms): 0.0; Power (Watts): 0.05W, 1/20W; Tolerance: Jumper; Value: 0R; Supplier 1: Digi-Key; Supplier Part Number 1: RHM0.0CCCT-ND; Number of Terminations: 2; Operating Temperature: -55°C ~ 125°C; Package / Case: 0201 (0603 Metric); Height: 0.010" (0.26mm); Supplier Device Package: 0201 (0603 Metric); Size / Dimension: 0.024" L x 0.012" W (0.60mm x 0.30mm); Temperature Coefficient: -; Category: Resistors; Features: -; RoHS: RoHS Compliant; Composition: Thick Film; Packaging: Cut Tape (CT)
R33 R39-R41 = Res_0402: Manufacturer: Panasonic Electronic Components; Manufacturer Part Number: ERJ-1GEF10R0C; Part Description: RES SMD 10 OHM 1% 1/20W 0201; Power (Watts): 0.05W, 1/20W; Resistance (Ohms): 10; Tolerance: ±1%; Temperature Coefficient: ±200ppm/°C; Value: 10R; Supplier 1: Digi-Key; Supplier Part Number 1: P10.0ABCT-ND; Package / Case: 0201 (0603 Metric); Height: 0.010" (0.26mm); Supplier Device Package: 0201; Packaging: Cut Tape (CT); Composition: Thick Film; Category: Resistors; Number of Terminations: 2; Size / Dimension: 0.024" L x 0.012" W (0.60mm x 0.30mm); Operating Temperature: -55°C ~ 125°C; Features: -; RoHS: RoHS Compliant

## Sheet 08_FPGA_banks_1_2_3_4.SchDoc: FPGA banks 1, 2, 3, 4
size A3; Organization: Lime Microsystems; Address1: Surrey Tech Centre; Address2: Guildford GU2 7YG; Address3: Surrey; Address4: United Kingdom; Revision: v1.4s; SheetNumber: 8; SheetTotal: 15
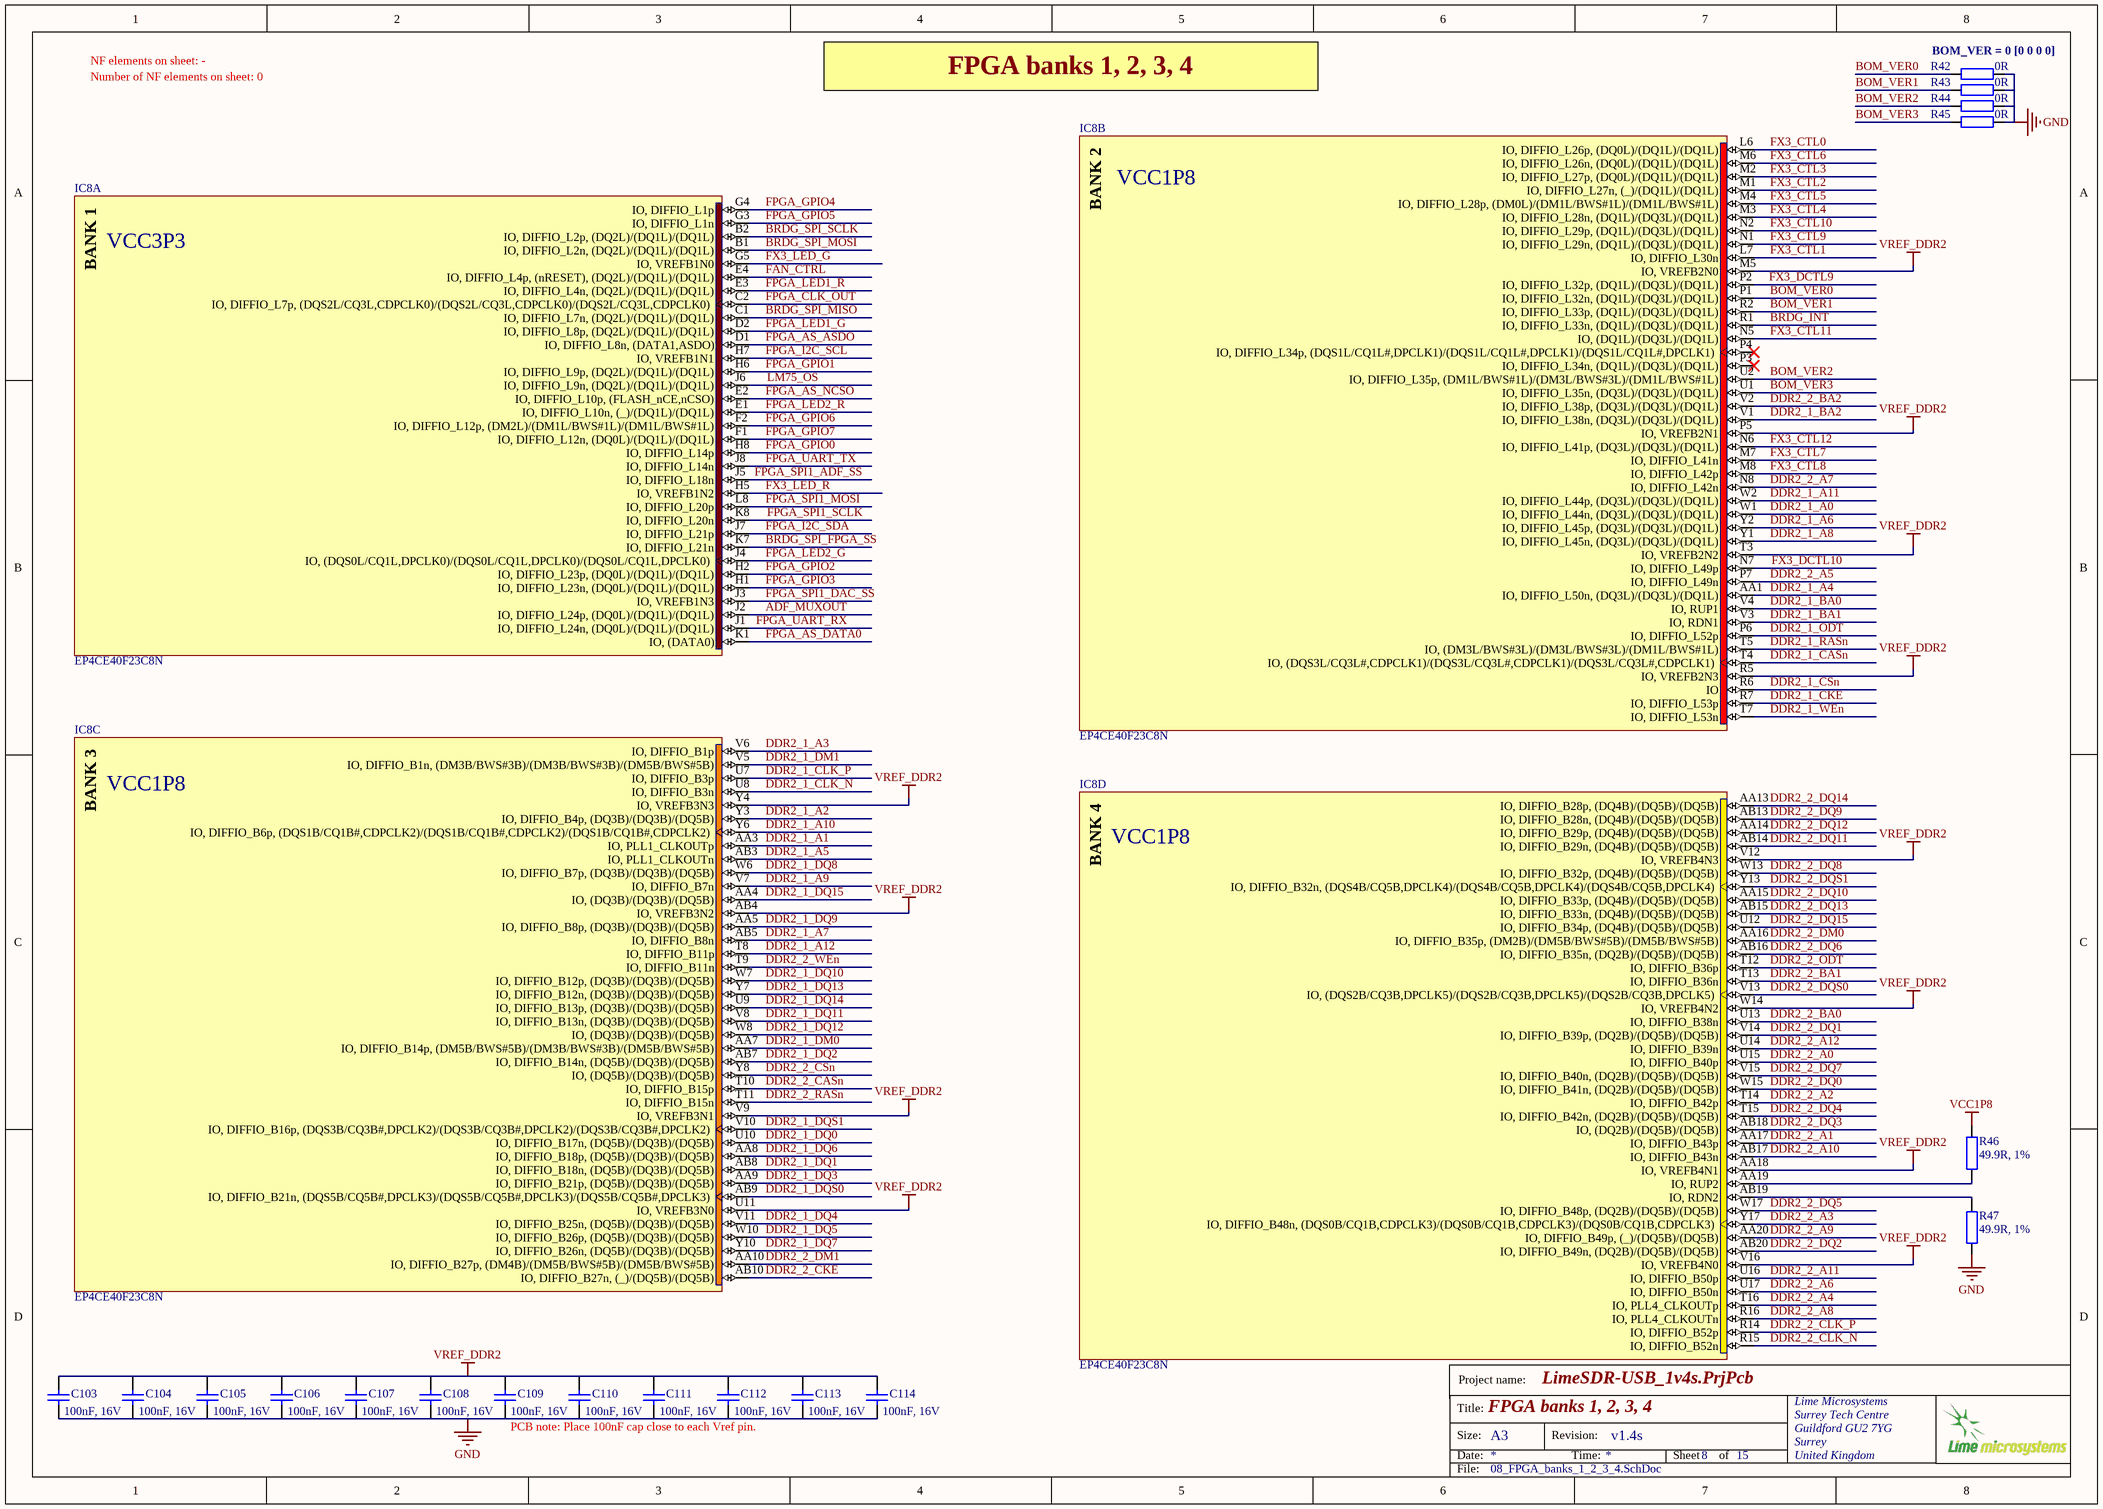
[diagram p7: 08_FPGA_banks_1_2_3_4.SchDoc]

### Parts
C103  100nF, 16V  [CAP0402]
C104  100nF, 16V  [CAP0402]
C105  100nF, 16V  [CAP0402]
C106  100nF, 16V  [CAP0402]
C107  100nF, 16V  [CAP0402]
C108  100nF, 16V  [CAP0402]
C109  100nF, 16V  [CAP0402]
C110  100nF, 16V  [CAP0402]
C111  100nF, 16V  [CAP0402]
C112  100nF, 16V  [CAP0402]
C113  100nF, 16V  [CAP0402]
C114  100nF, 16V  [CAP0402]
IC8  EP4CE40F23C8N  [FBGA484_A-240]  (parts A,B,C,D of 13)
R42  0R  [RES0402]
R43  0R  [RES0402]
R44  0R  [RES0402]
R45  0R  [RES0402]
R46  49.9R, 1%  [RES0402]
R47  49.9R, 1%  [RES0402]

### Nets
GND: C103.2 C104.2 C105.2 C106.2 C107.2 C108.2 C109.2 C110.2 C111.2 C112.2 C113.2 C114.2 R42.2 R43.2 R44.2 R45.2 R47.1
VCC1P8: R46.2
VREF_DDR2: C103.1 C104.1 C105.1 C106.1 C107.1 C108.1 C109.1 C110.1 C111.1 C112.1 C113.1 C114.1 IC8.AA18(IO,_VREFB4N1) IC8.AB4(IO,_VREFB3N2) IC8.M5(IO,_VREFB2N0) IC8.P5(IO,_VREFB2N1) IC8.R5(IO,_VREFB2N3) IC8.T3(IO,_VREFB2N2) IC8.U11(IO,_VREFB3N0) IC8.V9(IO,_VREFB3N1) IC8.V12(IO,_VREFB4N3) IC8.V16(IO,_VREFB4N0) IC8.W14(IO,_VREFB4N2) IC8.Y4(IO,_VREFB3N3)
ADF_MUXOUT: IC8.J2(IO,_DIFFIO_L24p,_(DQ0L)/(DQ1L)/(DQ1L))
BOM_VER0: IC8.P1(IO,_DIFFIO_L32n,_(DQ1L)/(DQ3L)/(DQ1L)) R42.1
BOM_VER1: IC8.R2(IO,_DIFFIO_L33p,_(DQ1L)/(DQ3L)/(DQ1L)) R43.1
BOM_VER2: IC8.U2(IO,_DIFFIO_L35p,_(DM1L/BWS#1L)/(DM3L/BWS#3L)/(DM1L/BWS#1L)) R44.1
BOM_VER3: IC8.U1(IO,_DIFFIO_L35n,_(DQ3L)/(DQ3L)/(DQ1L)) R45.1
BRDG_INT: IC8.R1(IO,_DIFFIO_L33n,_(DQ1L)/(DQ3L)/(DQ1L))
BRDG_SPI_FPGA_SS: IC8.K7(IO,_DIFFIO_L21n)
BRDG_SPI_MISO: IC8.C1(IO,_DIFFIO_L7n,_(DQ2L)/(DQ1L)/(DQ1L))
BRDG_SPI_MOSI: IC8.B1(IO,_DIFFIO_L2n,_(DQ2L)/(DQ1L)/(DQ1L))
BRDG_SPI_SCLK: IC8.B2(IO,_DIFFIO_L2p,_(DQ2L)/(DQ1L)/(DQ1L))
DDR2_1_A0: IC8.W1(IO,_DIFFIO_L44n,_(DQ3L)/(DQ3L)/(DQ1L))
DDR2_1_A1: IC8.AA3(IO,_PLL1_CLKOUTp)
DDR2_1_A2: IC8.Y3(IO,_DIFFIO_B4p,_(DQ3B)/(DQ3B)/(DQ5B))
DDR2_1_A3: IC8.V6(IO,_DIFFIO_B1p)
DDR2_1_A4: IC8.AA1(IO,_DIFFIO_L50n,_(DQ3L)/(DQ3L)/(DQ1L))
DDR2_1_A5: IC8.AB3(IO,_PLL1_CLKOUTn)
DDR2_1_A6: IC8.Y2(IO,_DIFFIO_L45p,_(DQ3L)/(DQ3L)/(DQ1L))
DDR2_1_A7: IC8.AB5(IO,_DIFFIO_B8n)
DDR2_1_A8: IC8.Y1(IO,_DIFFIO_L45n,_(DQ3L)/(DQ3L)/(DQ1L))
DDR2_1_A9: IC8.V7(IO,_DIFFIO_B7n)
DDR2_1_A10: IC8.Y6(IO,_DIFFIO_B6p,_(DQS1B/CQ1B#,CDPCLK2)/(DQS1B/CQ1B#,CDPCLK2)/(DQS1B/CQ1B#,CDPCLK2))
DDR2_1_A11: IC8.W2(IO,_DIFFIO_L44p,_(DQ3L)/(DQ3L)/(DQ1L))
DDR2_1_A12: IC8.T8(IO,_DIFFIO_B11p)
DDR2_1_BA0: IC8.V4(IO,_RUP1)
DDR2_1_BA1: IC8.V3(IO,_RDN1)
DDR2_1_BA2: IC8.V1(IO,_DIFFIO_L38n,_(DQ3L)/(DQ3L)/(DQ1L))
DDR2_1_CASn: IC8.T4(IO,_(DQS3L/CQ3L#,CDPCLK1)/(DQS3L/CQ3L#,CDPCLK1)/(DQS3L/CQ3L#,CDPCLK1))
DDR2_1_CKE: IC8.R7(IO,_DIFFIO_L53p)
DDR2_1_CLK_N: IC8.U8(IO,_DIFFIO_B3n)
DDR2_1_CLK_P: IC8.U7(IO,_DIFFIO_B3p)
DDR2_1_CSn: IC8.R6(IO)
DDR2_1_DM0: IC8.AA7(IO,_DIFFIO_B14p,_(DM5B/BWS#5B)/(DM3B/BWS#3B)/(DM5B/BWS#5B))
DDR2_1_DM1: IC8.V5(IO,_DIFFIO_B1n,_(DM3B/BWS#3B)/(DM3B/BWS#3B)/(DM5B/BWS#5B))
DDR2_1_DQ0: IC8.U10(IO,_DIFFIO_B17n,_(DQ5B)/(DQ3B)/(DQ5B))
DDR2_1_DQ1: IC8.AB8(IO,_DIFFIO_B18n,_(DQ5B)/(DQ3B)/(DQ5B))
DDR2_1_DQ2: IC8.AB7(IO,_DIFFIO_B14n,_(DQ5B)/(DQ3B)/(DQ5B))
DDR2_1_DQ3: IC8.AA9(IO,_DIFFIO_B21p,_(DQ5B)/(DQ3B)/(DQ5B))
DDR2_1_DQ4: IC8.V11(IO,_DIFFIO_B25n,_(DQ5B)/(DQ3B)/(DQ5B))
DDR2_1_DQ5: IC8.W10(IO,_DIFFIO_B26p,_(DQ5B)/(DQ3B)/(DQ5B))
DDR2_1_DQ6: IC8.AA8(IO,_DIFFIO_B18p,_(DQ5B)/(DQ3B)/(DQ5B))
DDR2_1_DQ7: IC8.Y10(IO,_DIFFIO_B26n,_(DQ5B)/(DQ3B)/(DQ5B))
DDR2_1_DQ8: IC8.W6(IO,_DIFFIO_B7p,_(DQ3B)/(DQ3B)/(DQ5B))
DDR2_1_DQ9: IC8.AA5(IO,_DIFFIO_B8p,_(DQ3B)/(DQ3B)/(DQ5B))
DDR2_1_DQ10: IC8.W7(IO,_DIFFIO_B12p,_(DQ3B)/(DQ3B)/(DQ5B))
DDR2_1_DQ11: IC8.V8(IO,_DIFFIO_B13n,_(DQ3B)/(DQ3B)/(DQ5B))
DDR2_1_DQ12: IC8.W8(IO,_(DQ3B)/(DQ3B)/(DQ5B))
DDR2_1_DQ13: IC8.Y7(IO,_DIFFIO_B12n,_(DQ3B)/(DQ3B)/(DQ5B))
DDR2_1_DQ14: IC8.U9(IO,_DIFFIO_B13p,_(DQ3B)/(DQ3B)/(DQ5B))
DDR2_1_DQ15: IC8.AA4(IO,_(DQ3B)/(DQ3B)/(DQ5B))
DDR2_1_DQS0: IC8.AB9(IO,_DIFFIO_B21n,_(DQS5B/CQ5B#,DPCLK3)/(DQS5B/CQ5B#,DPCLK3)/(DQS5B/CQ5B#,DPCLK3))
DDR2_1_DQS1: IC8.V10(IO,_DIFFIO_B16p,_(DQS3B/CQ3B#,DPCLK2)/(DQS3B/CQ3B#,DPCLK2)/(DQS3B/CQ3B#,DPCLK2))
DDR2_1_ODT: IC8.P6(IO,_DIFFIO_L52p)
DDR2_1_RASn: IC8.T5(IO,_(DM3L/BWS#3L)/(DM3L/BWS#3L)/(DM1L/BWS#1L))
DDR2_1_WEn: IC8.T7(IO,_DIFFIO_L53n)
DDR2_2_A0: IC8.U15(IO,_DIFFIO_B40p)
DDR2_2_A1: IC8.AA17(IO,_DIFFIO_B43p)
DDR2_2_A2: IC8.T14(IO,_DIFFIO_B42p)
DDR2_2_A3: IC8.Y17(IO,_DIFFIO_B48n,_(DQS0B/CQ1B,CDPCLK3)/(DQS0B/CQ1B,CDPCLK3)/(DQS0B/CQ1B,CDPCLK3))
DDR2_2_A4: IC8.T16(IO,_PLL4_CLKOUTp)
DDR2_2_A5: IC8.P7(IO,_DIFFIO_L49n)
DDR2_2_A6: IC8.U17(IO,_DIFFIO_B50n)
DDR2_2_A7: IC8.N8(IO,_DIFFIO_L42n)
DDR2_2_A8: IC8.R16(IO,_PLL4_CLKOUTn)
DDR2_2_A9: IC8.AA20(IO,_DIFFIO_B49p,_(_)/(DQ5B)/(DQ5B))
DDR2_2_A10: IC8.AB17(IO,_DIFFIO_B43n)
DDR2_2_A11: IC8.U16(IO,_DIFFIO_B50p)
DDR2_2_A12: IC8.U14(IO,_DIFFIO_B39n)
DDR2_2_BA0: IC8.U13(IO,_DIFFIO_B38n)
DDR2_2_BA1: IC8.T13(IO,_DIFFIO_B36n)
DDR2_2_BA2: IC8.V2(IO,_DIFFIO_L38p,_(DQ3L)/(DQ3L)/(DQ1L))
DDR2_2_CASn: IC8.T10(IO,_DIFFIO_B15p)
DDR2_2_CKE: IC8.AB10(IO,_DIFFIO_B27n,_(_)/(DQ5B)/(DQ5B))
DDR2_2_CLK_N: IC8.R15(IO,_DIFFIO_B52n)
DDR2_2_CLK_P: IC8.R14(IO,_DIFFIO_B52p)
DDR2_2_CSn: IC8.Y8(IO,_(DQ5B)/(DQ3B)/(DQ5B))
DDR2_2_DM0: IC8.AA16(IO,_DIFFIO_B35p,_(DM2B)/(DM5B/BWS#5B)/(DM5B/BWS#5B))
DDR2_2_DM1: IC8.AA10(IO,_DIFFIO_B27p,_(DM4B)/(DM5B/BWS#5B)/(DM5B/BWS#5B))
DDR2_2_DQ0: IC8.W15(IO,_DIFFIO_B41n,_(DQ2B)/(DQ5B)/(DQ5B))
DDR2_2_DQ1: IC8.V14(IO,_DIFFIO_B39p,_(DQ2B)/(DQ5B)/(DQ5B))
DDR2_2_DQ2: IC8.AB20(IO,_DIFFIO_B49n,_(DQ2B)/(DQ5B)/(DQ5B))
DDR2_2_DQ3: IC8.AB18(IO,_(DQ2B)/(DQ5B)/(DQ5B))
DDR2_2_DQ4: IC8.T15(IO,_DIFFIO_B42n,_(DQ2B)/(DQ5B)/(DQ5B))
DDR2_2_DQ5: IC8.W17(IO,_DIFFIO_B48p,_(DQ2B)/(DQ5B)/(DQ5B))
DDR2_2_DQ6: IC8.AB16(IO,_DIFFIO_B35n,_(DQ2B)/(DQ5B)/(DQ5B))
DDR2_2_DQ7: IC8.V15(IO,_DIFFIO_B40n,_(DQ2B)/(DQ5B)/(DQ5B))
DDR2_2_DQ8: IC8.W13(IO,_DIFFIO_B32p,_(DQ4B)/(DQ5B)/(DQ5B))
DDR2_2_DQ9: IC8.AB13(IO,_DIFFIO_B28n,_(DQ4B)/(DQ5B)/(DQ5B))
DDR2_2_DQ10: IC8.AA15(IO,_DIFFIO_B33p,_(DQ4B)/(DQ5B)/(DQ5B))
DDR2_2_DQ11: IC8.AB14(IO,_DIFFIO_B29n,_(DQ4B)/(DQ5B)/(DQ5B))
DDR2_2_DQ12: IC8.AA14(IO,_DIFFIO_B29p,_(DQ4B)/(DQ5B)/(DQ5B))
DDR2_2_DQ13: IC8.AB15(IO,_DIFFIO_B33n,_(DQ4B)/(DQ5B)/(DQ5B))
DDR2_2_DQ14: IC8.AA13(IO,_DIFFIO_B28p,_(DQ4B)/(DQ5B)/(DQ5B))
DDR2_2_DQ15: IC8.U12(IO,_DIFFIO_B34p,_(DQ4B)/(DQ5B)/(DQ5B))
DDR2_2_DQS0: IC8.V13(IO,_(DQS2B/CQ3B,DPCLK5)/(DQS2B/CQ3B,DPCLK5)/(DQS2B/CQ3B,DPCLK5))
DDR2_2_DQS1: IC8.Y13(IO,_DIFFIO_B32n,_(DQS4B/CQ5B,DPCLK4)/(DQS4B/CQ5B,DPCLK4)/(DQS4B/CQ5B,DPCLK4))
DDR2_2_ODT: IC8.T12(IO,_DIFFIO_B36p)
DDR2_2_RASn: IC8.T11(IO,_DIFFIO_B15n)
DDR2_2_WEn: IC8.T9(IO,_DIFFIO_B11n)
FAN_CTRL: IC8.E4(IO,_DIFFIO_L4p,_(nRESET),_(DQ2L)/(DQ1L)/(DQ1L))
FPGA_AS_ASDO: IC8.D1(IO,_DIFFIO_L8n,_(DATA1,ASDO))
FPGA_AS_DATA0: IC8.K1(IO,_(DATA0))
FPGA_AS_NCSO: IC8.E2(IO,_DIFFIO_L10p,_(FLASH_nCE,nCSO))
FPGA_CLK_OUT: IC8.C2(IO,_DIFFIO_L7p,_(DQS2L/CQ3L,CDPCLK0)/(DQS2L/CQ3L,CDPCLK0)/(DQS2L/CQ3L,CDPCLK0))
FPGA_GPIO0: IC8.H8(IO,_DIFFIO_L14p)
FPGA_GPIO1: IC8.H6(IO,_DIFFIO_L9p,_(DQ2L)/(DQ1L)/(DQ1L))
FPGA_GPIO2: IC8.H2(IO,_DIFFIO_L23p,_(DQ0L)/(DQ1L)/(DQ1L))
FPGA_GPIO3: IC8.H1(IO,_DIFFIO_L23n,_(DQ0L)/(DQ1L)/(DQ1L))
FPGA_GPIO4: IC8.G4(IO,_DIFFIO_L1p)
FPGA_GPIO5: IC8.G3(IO,_DIFFIO_L1n)
FPGA_GPIO6: IC8.F2(IO,_DIFFIO_L12p,_(DM2L)/(DM1L/BWS#1L)/(DM1L/BWS#1L))
FPGA_GPIO7: IC8.F1(IO,_DIFFIO_L12n,_(DQ0L)/(DQ1L)/(DQ1L))
FPGA_I2C_SCL: IC8.H7(IO,_VREFB1N1)
FPGA_I2C_SDA: IC8.J7(IO,_DIFFIO_L21p)
FPGA_LED1_G: IC8.D2(IO,_DIFFIO_L8p,_(DQ2L)/(DQ1L)/(DQ1L))
FPGA_LED1_R: IC8.E3(IO,_DIFFIO_L4n,_(DQ2L)/(DQ1L)/(DQ1L))
FPGA_LED2_G: IC8.J4(IO,_(DQS0L/CQ1L,DPCLK0)/(DQS0L/CQ1L,DPCLK0)/(DQS0L/CQ1L,DPCLK0))
FPGA_LED2_R: IC8.E1(IO,_DIFFIO_L10n,_(_)/(DQ1L)/(DQ1L))
FPGA_SPI1_ADF_SS: IC8.J5(IO,_DIFFIO_L18n)
FPGA_SPI1_DAC_SS: IC8.J3(IO,_VREFB1N3)
FPGA_SPI1_MOSI: IC8.L8(IO,_DIFFIO_L20p)
FPGA_SPI1_SCLK: IC8.K8(IO,_DIFFIO_L20n)
FPGA_UART_RX: IC8.J1(IO,_DIFFIO_L24n,_(DQ0L)/(DQ1L)/(DQ1L))
FPGA_UART_TX: IC8.J8(IO,_DIFFIO_L14n)
FX3_CTL0: IC8.L6(IO,_DIFFIO_L26p,_(DQ0L)/(DQ1L)/(DQ1L))
FX3_CTL1: IC8.L7(IO,_DIFFIO_L30n)
FX3_CTL2: IC8.M1(IO,_DIFFIO_L27n,_(_)/(DQ1L)/(DQ1L))
FX3_CTL3: IC8.M2(IO,_DIFFIO_L27p,_(DQ0L)/(DQ1L)/(DQ1L))
FX3_CTL4: IC8.M3(IO,_DIFFIO_L28n,_(DQ1L)/(DQ3L)/(DQ1L))
FX3_CTL5: IC8.M4(IO,_DIFFIO_L28p,_(DM0L)/(DM1L/BWS#1L)/(DM1L/BWS#1L))
FX3_CTL6: IC8.M6(IO,_DIFFIO_L26n,_(DQ0L)/(DQ1L)/(DQ1L))
FX3_CTL7: IC8.M7(IO,_DIFFIO_L41n)
FX3_CTL8: IC8.M8(IO,_DIFFIO_L42p)
FX3_CTL9: IC8.N1(IO,_DIFFIO_L29n,_(DQ1L)/(DQ3L)/(DQ1L))
FX3_CTL10: IC8.N2(IO,_DIFFIO_L29p,_(DQ1L)/(DQ3L)/(DQ1L))
FX3_CTL11: IC8.N5(IO,_(DQ1L)/(DQ3L)/(DQ1L))
FX3_CTL12: IC8.N6(IO,_DIFFIO_L41p,_(DQ3L)/(DQ3L)/(DQ1L))
FX3_DCTL9: IC8.P2(IO,_DIFFIO_L32p,_(DQ1L)/(DQ3L)/(DQ1L))
FX3_DCTL10: IC8.N7(IO,_DIFFIO_L49p)
FX3_LED_G: IC8.G5(IO,_VREFB1N0)
FX3_LED_R: IC8.H5(IO,_VREFB1N2)
LM75_OS: IC8.J6(IO,_DIFFIO_L9n,_(DQ2L)/(DQ1L)/(DQ1L))
NetIC8_AA19: IC8.AA19(IO,_RUP2) R46.1
NetIC8_AB19: IC8.AB19(IO,_RDN2) R47.2

Not connected (* = marked no-connect by the designer): IC8 P3(IO,_DIFFIO_L34n,_(DQ1L)/(DQ3L)/(DQ1L))* P4(IO,_DIFFIO_L34p,_(DQS1L/CQ1L#,DPCLK1)/(DQS1L/CQ1L#,DPCLK1)/(DQS1L/CQ1L#,DPCLK1))*

### Notes on the sheet
- NF elements on sheet: -
- Number of NF elements on sheet: 0
- FPGA banks 1, 2, 3, 4
- (near R42) BOM_VER = 0 [0 0 0 0]
- VCC3P3
- VCC1P8
- PCB note: Place 100nF cap close to each Vref pin.
- Project name:
- Title:
- Size:
- Date:
- A3
- Revision:
- Time:
- Sheet
- of
- File:
- (in symbol EP4CE40F23C7N, part A) BANK 1
- (in symbol EP4CE40F23C7N, part B) BANK 2
- (in symbol EP4CE40F23C7N, part C) BANK 3
- (in symbol EP4CE40F23C7N, part D) BANK 4

### Library data of the parts
C103-C114 = Cap_0603: Manufacturer Part Number 1: GRM155R71C104KA88D; Part Description: 0.10µF ±10% 16V X7R Ceramic Capacitor -55°C ~ 125°C Surface Mount, MLCC 0402 (1005 Metric) 0.039" L x 0.020" W (1.00mm x 0.50mm); Brand: Murata Electronics; Tolerance: 10 %; Type: General Purpose MLCC; Capacitance: 0.1 uF; Temperature Coefficient / Code: +/- 15 %; Supplier 1: Mouser; Supplier Part Number 1: 81-GRM155R71C104KA88; Case Code - in: 0402; Manufacturer: Murata Electronics; Category: Multilayer Ceramic Capacitors MLCC - SMD/SMT; Voltage Rating DC: 16 V; Value: 100nF, 16V; Manufacturer Part Number: GRM155R71C104KA88D
IC8 = EP4CE40F23C7N: IC FPGA 328 I/O 484FBGA; Manufacturer: Altera; Number of I/O: 328; Number of LABs/CLBs: 2475; Number of Logic Elements/Cells: 39600; Total RAM Bits: 1161216; Voltage - Supply: 1.15 V ~ 1.25 V; DatasheetVersion: ver1.6, Nov-2011; PackageDescription: 484-Pin FineLine Ball Grid Array (FBGA) - Wire Bond - A:2.40; Code_JEDEC: MS-034-AAJ-1; ComponentLink1Description: Manufacturer URL; ComponentLink1URL: http://www.altera.com/; ComponentLink2Description: Handbook; ComponentLink2URL: http://www.altera.com/literature/hb/cyclone-iv/cyclone4-handbook.pdf; ComponentLink3Description: Pinout; ComponentLink3URL: http://www.altera.com/literature/lit-dp.jsp?category=cyc%204&showspreadsheet=y; ComponentLink4Description: Package Specification; ComponentLink4URL: http://www.altera.com/devicepackaging/04R00247-02.pdf; Category: Integrated Circuits (ICs); Manufacturer Part Number 1: EP4CE40F23C8N; Mounting Type: Surface Mount; Number of Gates: -; Operating Temperature: 0°C ~ 85°C; Package / Case: 484-BGA; RoHS: RoHS Compliant; Supplier 1: Digi-Key; Supplier Device Package: 484-FBGA (23x23); Supplier Part Number 1: 544-2811-ND; Part Description: IC FPGA 328 I/O 484FBGA
R42-R45 = Res_0402: Manufacturer: Yageo; Part Description: RES SMD 0.0OHM JUMPER 1/16W 0402; Supplier 1: Digi-Key; Supplier Part Number 1: 311-0.0JRTR-ND; Composition: Thick Film; Package / Case: 0402 (1005 Metric); Category: Resistors; Value: 0R
R46 R47 = Res_0402: as R6 on sheet 04_LMS7002M_Misc; Number of Terminations: 2; Size / Dimension: 0.039" L x 0.020" W (1.00mm x 0.50mm); Supplier Device Package: 0402 (1005 Metric); RoHS: RoHS Compliant; Supplier Part Number 1: 1276-3469-6-ND; Features: -; Packaging: Digi-Reel®; Tolerance: ±1%; Height: 0.016" (0.40mm); Category: Resistors; Composition: Thick Film; Package / Case: 0402 (1005 Metric); Supplier 1: Digi-Key; Operating Temperature: -55°C ~ 155°C; Value: 49.9R, 1%